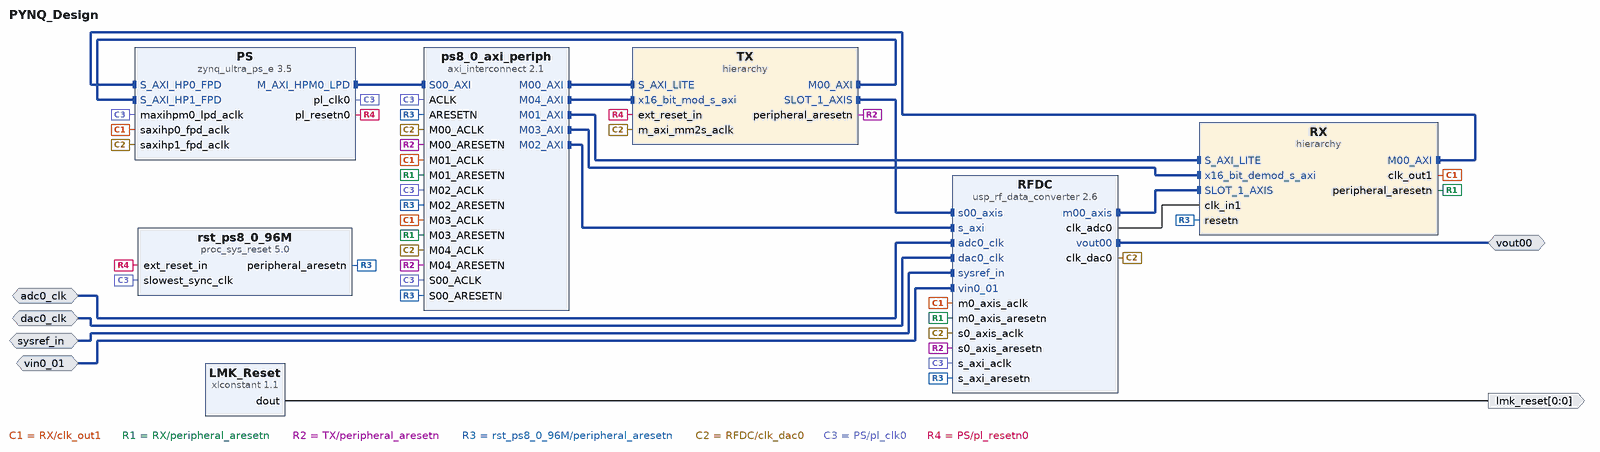
[diagram p0: block diagram of the top level]
# Vivado block design PYNQ_Design, xczu28dr-ffvg1517-2-e, Vivado 2024.1
create_bd_design PYNQ_Design

create_bd_intf_port -mode Slave -vlnv xilinx.com:display_usp_rf_data_converter:diff_pins_rtl:1.0 sysref_in
create_bd_intf_port -mode Slave -vlnv xilinx.com:interface:diff_clock_rtl:1.0 adc0_clk
set_property -dict {CONFIG.FREQ_HZ 204800000.0} [get_bd_intf_ports adc0_clk]
create_bd_intf_port -mode Slave -vlnv xilinx.com:interface:diff_analog_io_rtl:1.0 vin0_01
create_bd_intf_port -mode Slave -vlnv xilinx.com:interface:diff_clock_rtl:1.0 dac0_clk
set_property -dict {CONFIG.FREQ_HZ 204800000.0} [get_bd_intf_ports dac0_clk]
create_bd_intf_port -mode Master -vlnv xilinx.com:interface:diff_analog_io_rtl:1.0 vout00
create_bd_port -dir O -from 0 -to 0 lmk_reset

create_bd_cell -type ip -vlnv xilinx.com:ip:usp_rf_data_converter:2.6 RFDC
set_property -dict [list \
  CONFIG.ADC0_Outclk_Freq 64.000 \
  CONFIG.ADC0_PLL_Enable true \
  CONFIG.ADC0_Refclk_Freq 204.800 \
  CONFIG.ADC0_Sampling_Rate 1.024 \
  CONFIG.ADC_Data_Width00 1 \
  CONFIG.ADC_Decimation_Mode00 8 \
  CONFIG.DAC0_Outclk_Freq 128.000 \
  CONFIG.DAC0_PLL_Enable true \
  CONFIG.DAC0_Refclk_Freq 204.800 \
  CONFIG.DAC0_Sampling_Rate 1.024 \
  CONFIG.DAC_Data_Width00 1 \
  CONFIG.DAC_Interpolation_Mode00 8 \
  CONFIG.DAC_Slice00_Enable true \
] [get_bd_cells RFDC]
create_bd_cell -type ip -vlnv xilinx.com:ip:proc_sys_reset:5.0 rst_ps8_0_96M
create_bd_cell -type ip -vlnv xilinx.com:ip:axi_interconnect:2.1 ps8_0_axi_periph
set_property -dict {CONFIG.NUM_MI 5} [get_bd_cells ps8_0_axi_periph]
create_bd_cell -type hier RX
create_bd_cell -type hier TX
create_bd_cell -type ip -vlnv xilinx.com:ip:xlconstant:1.1 LMK_Reset
set_property -dict {CONFIG.CONST_VAL 0} [get_bd_cells LMK_Reset]
create_bd_cell -type ip -vlnv xilinx.com:ip:zynq_ultra_ps_e:3.5 PS
set_property -dict [list \
  CONFIG.PSU__DDR_HIGH_ADDRESS_GUI_ENABLE 0 \
  CONFIG.PSU__USE__S_AXI_GP2 1 \
  CONFIG.PSU__USE__S_AXI_GP3 1 \
] [get_bd_cells PS]
# 11 more settings of PS are not shown: defaults, MIO pin electricals, DDR timing, and values the tool derives

# ---- hierarchy /RX ----
current_bd_instance /RX
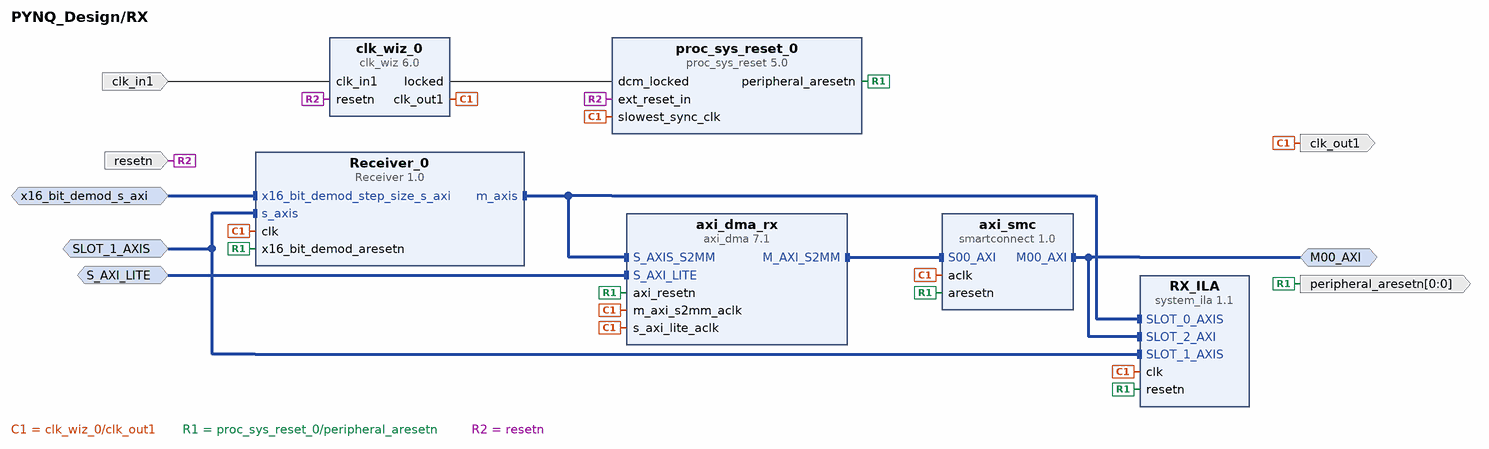
[diagram p1: block diagram inside /RX]
create_bd_intf_pin -mode Master -vlnv xilinx.com:interface:aximm_rtl:1.0 M00_AXI
create_bd_intf_pin -mode Slave -vlnv xilinx.com:interface:axis_rtl:1.0 SLOT_1_AXIS
create_bd_intf_pin -mode Slave -vlnv xilinx.com:interface:aximm_rtl:1.0 S_AXI_LITE
create_bd_intf_pin -mode Slave -vlnv xilinx.com:interface:aximm_rtl:1.0 x16_bit_demod_s_axi
create_bd_pin -dir O -type clk clk_out1
create_bd_pin -dir O -from 0 -to 0 -type rst peripheral_aresetn
create_bd_pin -dir I -type rst resetn
create_bd_pin -dir I -type clk clk_in1

create_bd_cell -type ip -vlnv xilinx.com:ip:smartconnect:1.0 axi_smc
set_property -dict {CONFIG.NUM_CLKS 1 CONFIG.NUM_SI 1} [get_bd_cells axi_smc]
create_bd_cell -type ip -vlnv xilinx.com:ip:proc_sys_reset:5.0 proc_sys_reset_0
create_bd_cell -type ip -vlnv xilinx.com:ip:system_ila:1.1 RX_ILA
set_property -dict [list \
  CONFIG.C_DATA_DEPTH 8192 \
  CONFIG.C_MON_TYPE INTERFACE \
  CONFIG.C_NUM_MONITOR_SLOTS 3 \
  CONFIG.C_SLOT_0_APC_EN 0 \
  CONFIG.C_SLOT_0_AXI_DATA_SEL 1 \
  CONFIG.C_SLOT_0_AXI_TRIG_SEL 1 \
  CONFIG.C_SLOT_0_INTF_TYPE xilinx.com:interface:axis_rtl:1.0 \
  CONFIG.C_SLOT_1_APC_EN 0 \
  CONFIG.C_SLOT_1_AXI_DATA_SEL 1 \
  CONFIG.C_SLOT_1_AXI_TRIG_SEL 1 \
  CONFIG.C_SLOT_1_INTF_TYPE xilinx.com:interface:axis_rtl:1.0 \
  CONFIG.C_SLOT_2_APC_EN 0 \
  CONFIG.C_SLOT_2_AXI_AR_SEL_DATA 1 \
  CONFIG.C_SLOT_2_AXI_AR_SEL_TRIG 1 \
  CONFIG.C_SLOT_2_AXI_AW_SEL_DATA 1 \
  CONFIG.C_SLOT_2_AXI_AW_SEL_TRIG 1 \
  CONFIG.C_SLOT_2_AXI_B_SEL_DATA 1 \
  CONFIG.C_SLOT_2_AXI_B_SEL_TRIG 1 \
  CONFIG.C_SLOT_2_AXI_R_SEL_DATA 1 \
  CONFIG.C_SLOT_2_AXI_R_SEL_TRIG 1 \
  CONFIG.C_SLOT_2_AXI_W_SEL_DATA 1 \
  CONFIG.C_SLOT_2_AXI_W_SEL_TRIG 1 \
  CONFIG.C_SLOT_2_INTF_TYPE xilinx.com:interface:aximm_rtl:1.0 \
] [get_bd_cells RX_ILA]
create_bd_cell -type ip -vlnv xilinx.com:ip:axi_dma:7.1 axi_dma_rx
set_property -dict [list \
  CONFIG.c_addr_width 64 \
  CONFIG.c_include_mm2s 0 \
  CONFIG.c_include_sg 0 \
  CONFIG.c_m_axi_s2mm_data_width 128 \
  CONFIG.c_s2mm_burst_size 256 \
  CONFIG.c_s_axis_s2mm_tdata_width 32 \
  CONFIG.c_sg_length_width 26 \
] [get_bd_cells axi_dma_rx]
create_bd_cell -type ip -vlnv xilinx.com:ip:clk_wiz:6.0 clk_wiz_0
set_property -dict [list \
  CONFIG.CLKIN1_JITTER_PS 156.25 \
  CONFIG.CLKIN2_JITTER_PS 234.37000000000003 \
  CONFIG.CLKOUT1_JITTER 120.187 \
  CONFIG.CLKOUT1_PHASE_ERROR 121.856 \
  CONFIG.CLKOUT1_REQUESTED_OUT_FREQ 128 \
  CONFIG.MMCM_CLKFBOUT_MULT_F 18.750 \
  CONFIG.MMCM_CLKIN1_PERIOD 15.625 \
  CONFIG.MMCM_CLKIN2_PERIOD 10.0 \
  CONFIG.MMCM_CLKOUT0_DIVIDE_F 9.375 \
  CONFIG.PRIM_SOURCE Global_buffer \
  CONFIG.RESET_PORT resetn \
  CONFIG.RESET_TYPE ACTIVE_LOW \
  CONFIG.SECONDARY_IN_FREQ 100.000 \
  CONFIG.SECONDARY_SOURCE Single_ended_clock_capable_pin \
  CONFIG.USE_INCLK_SWITCHOVER false \
] [get_bd_cells clk_wiz_0]
create_bd_cell -type ip -vlnv User_Company:VMC:Receiver:1.0 Receiver_0

# ---- hierarchy /TX ----
current_bd_instance /TX
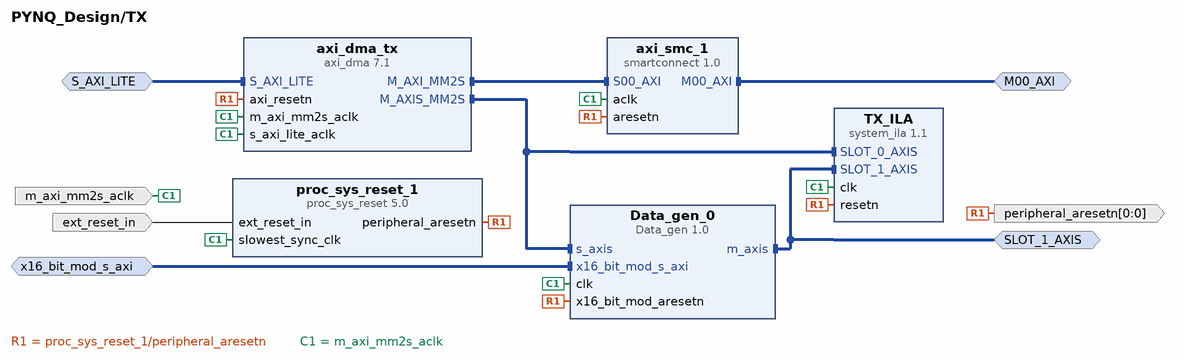
[diagram p2: block diagram inside /TX]
create_bd_intf_pin -mode Master -vlnv xilinx.com:interface:axis_rtl:1.0 SLOT_1_AXIS
create_bd_intf_pin -mode Slave -vlnv xilinx.com:interface:aximm_rtl:1.0 S_AXI_LITE
create_bd_intf_pin -mode Master -vlnv xilinx.com:interface:aximm_rtl:1.0 M00_AXI
create_bd_intf_pin -mode Slave -vlnv xilinx.com:interface:aximm_rtl:1.0 x16_bit_mod_s_axi
create_bd_pin -dir I -type clk m_axi_mm2s_aclk
create_bd_pin -dir O -from 0 -to 0 -type rst peripheral_aresetn
create_bd_pin -dir I -type rst ext_reset_in

create_bd_cell -type ip -vlnv xilinx.com:ip:axi_dma:7.1 axi_dma_tx
set_property -dict [list \
  CONFIG.c_include_mm2s_dre 1 \
  CONFIG.c_include_s2mm 0 \
  CONFIG.c_include_sg 0 \
  CONFIG.c_m_axi_mm2s_data_width 128 \
  CONFIG.c_m_axis_mm2s_tdata_width 32 \
  CONFIG.c_mm2s_burst_size 256 \
] [get_bd_cells axi_dma_tx]
create_bd_cell -type ip -vlnv xilinx.com:ip:proc_sys_reset:5.0 proc_sys_reset_1
create_bd_cell -type ip -vlnv xilinx.com:ip:smartconnect:1.0 axi_smc_1
set_property -dict {CONFIG.NUM_CLKS 1 CONFIG.NUM_SI 1} [get_bd_cells axi_smc_1]
create_bd_cell -type ip -vlnv xilinx.com:ip:system_ila:1.1 TX_ILA
set_property -dict [list \
  CONFIG.C_DATA_DEPTH 8192 \
  CONFIG.C_MON_TYPE INTERFACE \
  CONFIG.C_NUM_MONITOR_SLOTS 2 \
  CONFIG.C_SLOT_0_APC_EN 0 \
  CONFIG.C_SLOT_0_AXI_DATA_SEL 1 \
  CONFIG.C_SLOT_0_AXI_TRIG_SEL 1 \
  CONFIG.C_SLOT_0_INTF_TYPE xilinx.com:interface:axis_rtl:1.0 \
  CONFIG.C_SLOT_1_APC_EN 0 \
  CONFIG.C_SLOT_1_AXI_DATA_SEL 1 \
  CONFIG.C_SLOT_1_AXI_TRIG_SEL 1 \
  CONFIG.C_SLOT_1_INTF_TYPE xilinx.com:interface:axis_rtl:1.0 \
] [get_bd_cells TX_ILA]
create_bd_cell -type ip -vlnv User_Company:VMC:Data_gen:1.0 Data_gen_0

# ---- connections ----

current_bd_instance /RX
connect_bd_intf_net [get_bd_intf_pins Receiver_0/x16_bit_demod_step_size_s_axi] [get_bd_intf_pins x16_bit_demod_s_axi]
connect_bd_intf_net -intf_net DUT_0_m_axis [get_bd_intf_pins axi_dma_rx/S_AXIS_S2MM] [get_bd_intf_pins Receiver_0/m_axis]
connect_bd_intf_net [get_bd_intf_pins axi_dma_rx/S_AXIS_S2MM] [get_bd_intf_pins RX_ILA/SLOT_0_AXIS]
connect_bd_intf_net [get_bd_intf_pins axi_dma_rx/M_AXI_S2MM] [get_bd_intf_pins axi_smc/S00_AXI]
connect_bd_intf_net -intf_net axi_smc_M00_AXI [get_bd_intf_pins M00_AXI] [get_bd_intf_pins axi_smc/M00_AXI]
connect_bd_intf_net [get_bd_intf_pins M00_AXI] [get_bd_intf_pins RX_ILA/SLOT_2_AXI]
connect_bd_intf_net [get_bd_intf_pins S_AXI_LITE] [get_bd_intf_pins axi_dma_rx/S_AXI_LITE]
connect_bd_intf_net -intf_net usp_rf_data_converter_0_m00_axis [get_bd_intf_pins SLOT_1_AXIS] [get_bd_intf_pins Receiver_0/s_axis]
connect_bd_intf_net [get_bd_intf_pins SLOT_1_AXIS] [get_bd_intf_pins RX_ILA/SLOT_1_AXIS]
connect_bd_net [get_bd_pins clk_wiz_0/clk_out1] \
  [get_bd_pins clk_out1] [get_bd_pins RX_ILA/clk] [get_bd_pins axi_dma_rx/s_axi_lite_aclk] \
  [get_bd_pins axi_dma_rx/m_axi_s2mm_aclk] [get_bd_pins Receiver_0/clk] [get_bd_pins axi_smc/aclk] \
  [get_bd_pins proc_sys_reset_0/slowest_sync_clk]
connect_bd_net [get_bd_pins clk_wiz_0/locked] [get_bd_pins proc_sys_reset_0/dcm_locked]
connect_bd_net [get_bd_pins proc_sys_reset_0/peripheral_aresetn] \
  [get_bd_pins peripheral_aresetn] [get_bd_pins RX_ILA/resetn] [get_bd_pins axi_dma_rx/axi_resetn] \
  [get_bd_pins Receiver_0/x16_bit_demod_aresetn] [get_bd_pins axi_smc/aresetn]
connect_bd_net -net rst_ps8_0_96M_peripheral_aresetn [get_bd_pins resetn] [get_bd_pins clk_wiz_0/resetn] [get_bd_pins proc_sys_reset_0/ext_reset_in]
connect_bd_net -net usp_rf_data_converter_0_clk_adc0 [get_bd_pins clk_in1] [get_bd_pins clk_wiz_0/clk_in1]
set_property HDL_ATTRIBUTE.DEBUG true [get_bd_intf_nets axi_smc_M00_AXI]
set_property HDL_ATTRIBUTE.DEBUG true [get_bd_intf_nets usp_rf_data_converter_0_m00_axis]

current_bd_instance /TX
connect_bd_intf_net [get_bd_intf_pins Data_gen_0/x16_bit_mod_s_axi] [get_bd_intf_pins x16_bit_mod_s_axi]
connect_bd_intf_net -intf_net DUT_data_in_0_m_axis [get_bd_intf_pins SLOT_1_AXIS] [get_bd_intf_pins Data_gen_0/m_axis]
connect_bd_intf_net [get_bd_intf_pins SLOT_1_AXIS] [get_bd_intf_pins TX_ILA/SLOT_1_AXIS]
connect_bd_intf_net -intf_net axi_dma_M_AXIS_MM2S [get_bd_intf_pins Data_gen_0/s_axis] [get_bd_intf_pins axi_dma_tx/M_AXIS_MM2S]
connect_bd_intf_net [get_bd_intf_pins Data_gen_0/s_axis] [get_bd_intf_pins TX_ILA/SLOT_0_AXIS]
connect_bd_intf_net [get_bd_intf_pins axi_dma_tx/M_AXI_MM2S] [get_bd_intf_pins axi_smc_1/S00_AXI]
connect_bd_intf_net [get_bd_intf_pins M00_AXI] [get_bd_intf_pins axi_smc_1/M00_AXI]
connect_bd_intf_net [get_bd_intf_pins S_AXI_LITE] [get_bd_intf_pins axi_dma_tx/S_AXI_LITE]
connect_bd_net [get_bd_pins proc_sys_reset_1/peripheral_aresetn] \
  [get_bd_pins peripheral_aresetn] [get_bd_pins TX_ILA/resetn] [get_bd_pins axi_dma_tx/axi_resetn] \
  [get_bd_pins Data_gen_0/x16_bit_mod_aresetn] [get_bd_pins axi_smc_1/aresetn]
connect_bd_net -net usp_rf_data_converter_0_clk_dac0 [get_bd_pins m_axi_mm2s_aclk] \
  [get_bd_pins axi_dma_tx/m_axi_mm2s_aclk] [get_bd_pins TX_ILA/clk] [get_bd_pins axi_dma_tx/s_axi_lite_aclk] \
  [get_bd_pins Data_gen_0/clk] [get_bd_pins axi_smc_1/aclk] [get_bd_pins proc_sys_reset_1/slowest_sync_clk]
connect_bd_net -net zynq_ultra_ps_e_0_pl_resetn0 [get_bd_pins ext_reset_in] [get_bd_pins proc_sys_reset_1/ext_reset_in]
set_property HDL_ATTRIBUTE.DEBUG true [get_bd_intf_nets DUT_data_in_0_m_axis]
set_property HDL_ATTRIBUTE.DEBUG true [get_bd_intf_nets axi_dma_M_AXIS_MM2S]
set_property HDL_ATTRIBUTE.MARK_DEBUG true [get_bd_intf_nets axi_dma_M_AXIS_MM2S]

current_bd_instance /
connect_bd_intf_net -intf_net DUT_data_in_0_m_axis [get_bd_intf_pins TX/SLOT_1_AXIS] [get_bd_intf_pins RFDC/s00_axis]
connect_bd_intf_net -intf_net RX_M00_AXI [get_bd_intf_pins RX/M00_AXI] [get_bd_intf_pins PS/S_AXI_HP0_FPD]
connect_bd_intf_net [get_bd_intf_pins PS/S_AXI_HP1_FPD] [get_bd_intf_pins TX/M00_AXI]
connect_bd_intf_net [get_bd_intf_ports adc0_clk] [get_bd_intf_pins RFDC/adc0_clk]
connect_bd_intf_net [get_bd_intf_ports dac0_clk] [get_bd_intf_pins RFDC/dac0_clk]
connect_bd_intf_net [get_bd_intf_pins ps8_0_axi_periph/M00_AXI] [get_bd_intf_pins TX/S_AXI_LITE]
connect_bd_intf_net [get_bd_intf_pins ps8_0_axi_periph/M01_AXI] [get_bd_intf_pins RX/S_AXI_LITE]
connect_bd_intf_net [get_bd_intf_pins ps8_0_axi_periph/M02_AXI] [get_bd_intf_pins RFDC/s_axi]
connect_bd_intf_net [get_bd_intf_pins ps8_0_axi_periph/M03_AXI] [get_bd_intf_pins RX/x16_bit_demod_s_axi]
connect_bd_intf_net [get_bd_intf_pins ps8_0_axi_periph/M04_AXI] [get_bd_intf_pins TX/x16_bit_mod_s_axi]
connect_bd_intf_net [get_bd_intf_ports sysref_in] [get_bd_intf_pins RFDC/sysref_in]
connect_bd_intf_net -intf_net usp_rf_data_converter_0_m00_axis [get_bd_intf_pins RFDC/m00_axis] [get_bd_intf_pins RX/SLOT_1_AXIS]
connect_bd_intf_net -intf_net usp_rf_data_converter_0_vout00 [get_bd_intf_ports vout00] [get_bd_intf_pins RFDC/vout00]
connect_bd_intf_net -intf_net vin0_01_1 [get_bd_intf_ports vin0_01] [get_bd_intf_pins RFDC/vin0_01]
connect_bd_intf_net -intf_net zynq_ultra_ps_e_0_M_AXI_HPM0_LPD [get_bd_intf_pins PS/M_AXI_HPM0_LPD] [get_bd_intf_pins ps8_0_axi_periph/S00_AXI]
connect_bd_net -net clk_wiz_0_clk_out1 [get_bd_pins RX/clk_out1] \
  [get_bd_pins RFDC/m0_axis_aclk] [get_bd_pins ps8_0_axi_periph/M01_ACLK] [get_bd_pins ps8_0_axi_periph/M03_ACLK] \
  [get_bd_pins PS/saxihp0_fpd_aclk]
connect_bd_net -net proc_sys_reset_0_peripheral_aresetn [get_bd_pins RX/peripheral_aresetn] \
  [get_bd_pins RFDC/m0_axis_aresetn] [get_bd_pins ps8_0_axi_periph/M01_ARESETN] [get_bd_pins ps8_0_axi_periph/M03_ARESETN]
connect_bd_net -net proc_sys_reset_1_peripheral_aresetn [get_bd_pins TX/peripheral_aresetn] \
  [get_bd_pins RFDC/s0_axis_aresetn] [get_bd_pins ps8_0_axi_periph/M00_ARESETN] [get_bd_pins ps8_0_axi_periph/M04_ARESETN]
connect_bd_net [get_bd_pins rst_ps8_0_96M/peripheral_aresetn] \
  [get_bd_pins ps8_0_axi_periph/S00_ARESETN] [get_bd_pins ps8_0_axi_periph/ARESETN] [get_bd_pins RX/resetn] \
  [get_bd_pins RFDC/s_axi_aresetn] [get_bd_pins ps8_0_axi_periph/M02_ARESETN]
connect_bd_net -net usp_rf_data_converter_0_clk_adc0 [get_bd_pins RFDC/clk_adc0] [get_bd_pins RX/clk_in1]
connect_bd_net -net usp_rf_data_converter_0_clk_dac0 [get_bd_pins RFDC/clk_dac0] \
  [get_bd_pins RFDC/s0_axis_aclk] [get_bd_pins ps8_0_axi_periph/M00_ACLK] [get_bd_pins TX/m_axi_mm2s_aclk] \
  [get_bd_pins ps8_0_axi_periph/M04_ACLK] [get_bd_pins PS/saxihp1_fpd_aclk]
connect_bd_net -net xlconstant_0_dout [get_bd_pins LMK_Reset/dout] [get_bd_ports lmk_reset]
connect_bd_net -net zynq_ultra_ps_e_0_pl_clk0 [get_bd_pins PS/pl_clk0] \
  [get_bd_pins ps8_0_axi_periph/ACLK] [get_bd_pins ps8_0_axi_periph/S00_ACLK] [get_bd_pins RFDC/s_axi_aclk] \
  [get_bd_pins ps8_0_axi_periph/M02_ACLK] [get_bd_pins rst_ps8_0_96M/slowest_sync_clk] [get_bd_pins PS/maxihpm0_lpd_aclk]
connect_bd_net -net zynq_ultra_ps_e_0_pl_resetn0 [get_bd_pins PS/pl_resetn0] [get_bd_pins TX/ext_reset_in] [get_bd_pins rst_ps8_0_96M/ext_reset_in]
set_property HDL_ATTRIBUTE.DEBUG true [get_bd_intf_nets DUT_data_in_0_m_axis]
set_property HDL_ATTRIBUTE.MARK_DEBUG true [get_bd_intf_nets DUT_data_in_0_m_axis]
set_property HDL_ATTRIBUTE.DEBUG true [get_bd_intf_nets RX_M00_AXI]
set_property HDL_ATTRIBUTE.DEBUG true [get_bd_intf_nets usp_rf_data_converter_0_m00_axis]
set_property HDL_ATTRIBUTE.MARK_DEBUG true [get_bd_intf_nets usp_rf_data_converter_0_m00_axis]

# ---- address map ----
assign_bd_address -offset 0x0080000000 -range 256K -target_address_space [get_bd_addr_spaces PS/Data] [get_bd_addr_segs RFDC/s_axi/Reg]
assign_bd_address -offset 0x0080040000 -range 64K -target_address_space [get_bd_addr_spaces PS/Data] [get_bd_addr_segs RX/axi_dma_rx/S_AXI_LITE/Reg]
assign_bd_address -offset 0x0080050000 -range 64K -target_address_space [get_bd_addr_spaces PS/Data] [get_bd_addr_segs TX/axi_dma_tx/S_AXI_LITE/Reg]
assign_bd_address -offset 0x0080060000 -range 64K -target_address_space [get_bd_addr_spaces PS/Data] [get_bd_addr_segs RX/Receiver_0/x16_bit_demod_step_size_s_axi/reg0]
assign_bd_address -offset 0x0080070000 -range 64K -target_address_space [get_bd_addr_spaces PS/Data] [get_bd_addr_segs TX/Data_gen_0/x16_bit_mod_s_axi/reg0]
assign_bd_address -offset 0x0000000000000000 -range 2G -target_address_space [get_bd_addr_spaces RX/axi_dma_rx/Data_S2MM] [get_bd_addr_segs PS/SAXIGP2/HP0_DDR_LOW]
exclude_bd_addr_seg -offset 0x00000000FF000000 -range 16M -target_address_space [get_bd_addr_spaces RX/axi_dma_rx/Data_S2MM] [get_bd_addr_segs PS/SAXIGP2/HP0_LPS_OCM]
assign_bd_address -offset 0x00000000 -range 2G -target_address_space [get_bd_addr_spaces TX/axi_dma_tx/Data_MM2S] [get_bd_addr_segs PS/SAXIGP3/HP1_DDR_LOW]
exclude_bd_addr_seg -offset 0xFF000000 -range 16M -target_address_space [get_bd_addr_spaces TX/axi_dma_tx/Data_MM2S] [get_bd_addr_segs PS/SAXIGP3/HP1_LPS_OCM]

validate_bd_design
save_bd_design
